# EAGLE design PiezoPreamp (EAGLE 7.5.0)
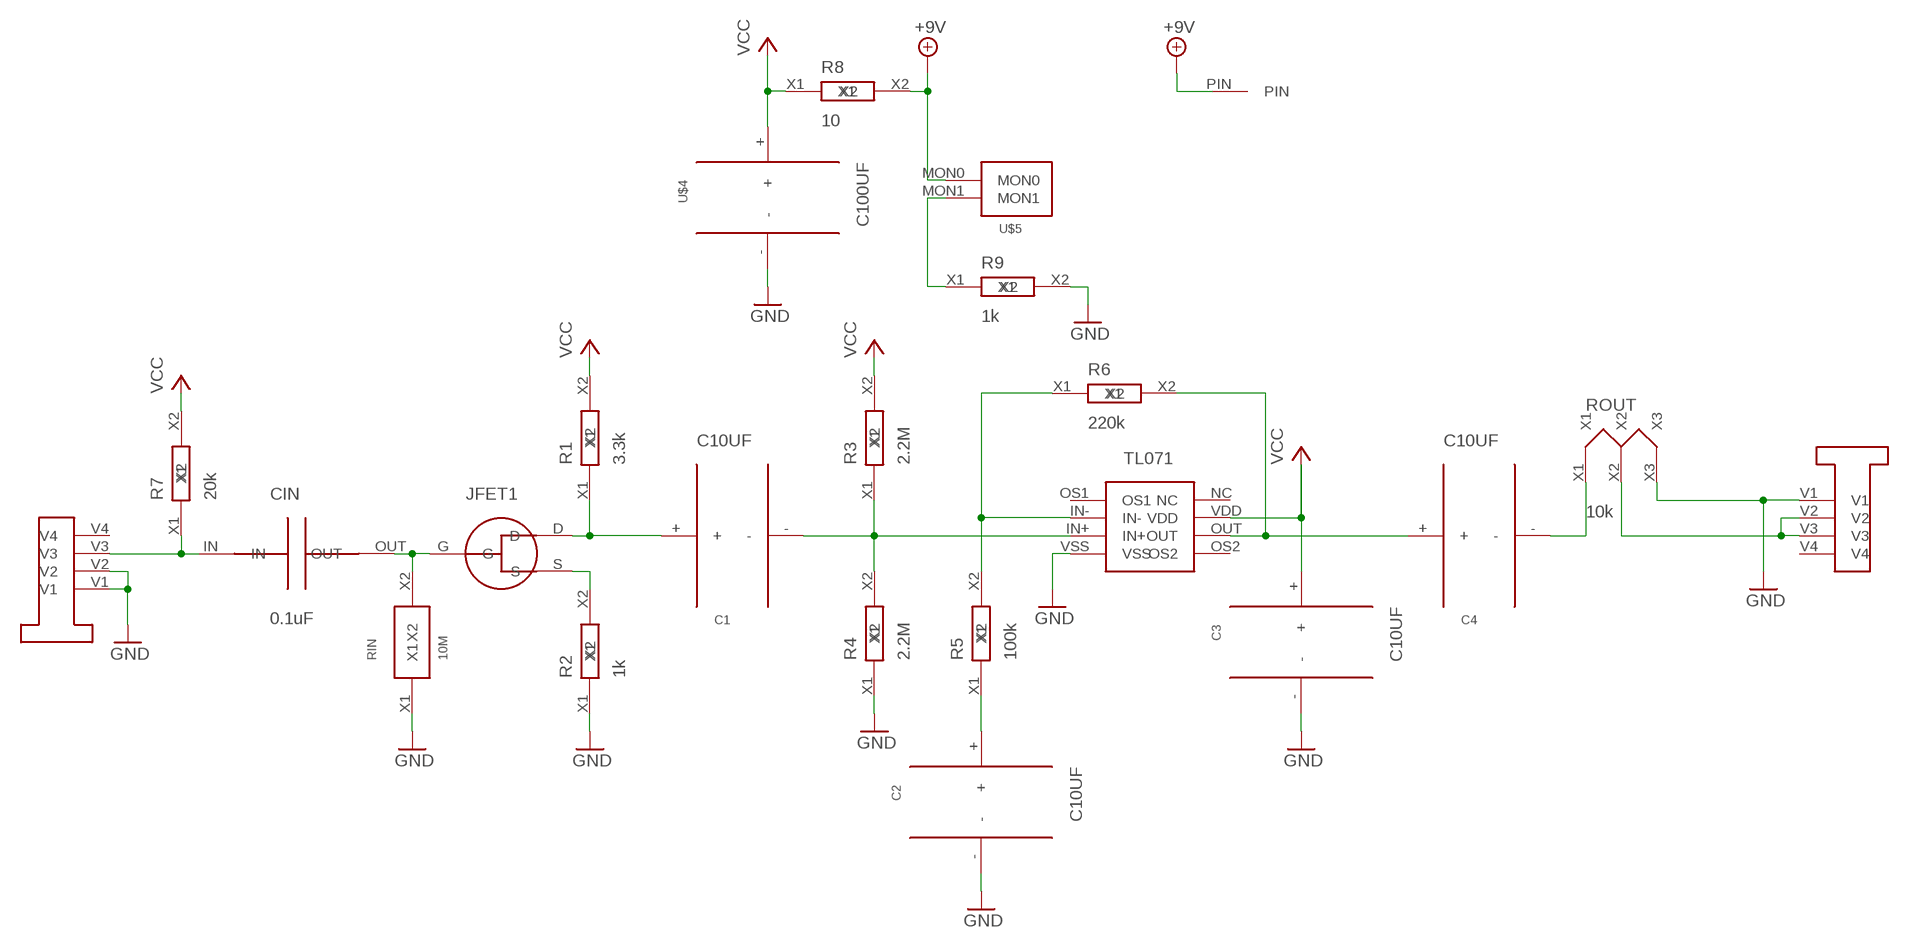
[diagram p0: schematic, sheet 1]

## Parts
C1  C10UF  [C10UF]
C2  C10UF  [C10UF]
C3  C10UF  [C10UF]
C4  C10UF  [C10UF]
CIN  0.1uF  C_CER_5MM  [C_CER_5MM]
JFET1  2N5457_H  [2N5457_H]
R1  3.3k  R_SMD_2.1X1.25  [SMD_2.1X1.25]
R2  1k  R_SMD_2.1X1.25  [SMD_2.1X1.25]
R3  2.2M  R_SMD_2.1X1.25  [SMD_2.1X1.25]
R4  2.2M  R_SMD_2.1X1.25  [SMD_2.1X1.25]
R5  100k  R_SMD_2.1X1.25  [SMD_2.1X1.25]
R6  220k  R_SMD_2.1X1.25  [SMD_2.1X1.25]
R7  20k  R_SMD_2.1X1.25  [SMD_2.1X1.25]
R8  10  R_SMD_2.1X1.25  [SMD_2.1X1.25]
R9  1k  R_SMD_2.1X1.25  [SMD_2.1X1.25]
RIN  10M  R_MOM  [R_MOM]
ROUT  10k  R_VAR_PTV09A  [R_VAR_PTV09A]
TL071  TL071  [TL071]
U$1  ST_AUDIO  [ST_AUDIO]
U$2  ST_AUDIO  [ST_AUDIO]
U$3  PIN_1  [PIN_1]
U$4  C100UF  [C100UF]
U$5  MON2PIN  [MON2PIN]

## Nets
+9V: R8.X2 U$3.PIN U$5.MON0
GND: C2.- C3.- R2.X1 R4.X1 R9.X2 RIN.X1 ROUT.X3 TL071.VSS U$1.V1 U$1.V2 U$2.V1 U$4.-
N$1: CIN.OUT JFET1.G RIN.X2
N$2: C1.+ JFET1.D R1.X1
N$3: JFET1.S R2.X2
N$4: C1.- R3.X1 R4.X2 TL071.IN+
N$5: C2.+ R5.X1
N$6: R5.X2 R6.X1 TL071.IN-
N$7: C4.+ R6.X2 TL071.OUT
N$8: CIN.IN R7.X1 U$1.V3
N$9: R9.X1 U$5.MON1
N$10: ROUT.X2 U$2.V2 U$2.V3
N$11: C4.- ROUT.X1
VCC: C3.+ R1.X2 R3.X2 R7.X2 R8.X1 TL071.VDD U$4.+
Unconnected: TL071.NC TL071.OS1 TL071.OS2 U$1.V4 U$2.V4

## Library data of the parts
C1-C4 = MyAmps:C10UF
CIN = MyDuino:C_CER_5MM
JFET1 = MyAmps:2N5457_H
R1-R9 = MyPowerComponents:R_SMD_2.1X1.25
RIN = MyAmps:R_MOM
ROUT = MyAmps:R_VAR_PTV09A
TL071 = MyAmps:TL071
U$1 U$2 = My_STM32F767:ST_AUDIO
U$3 = My_BLE:PIN_1
U$4 = MyAmps:C100UF
U$5 = MyCMOSsensor:MON2PIN

## Board
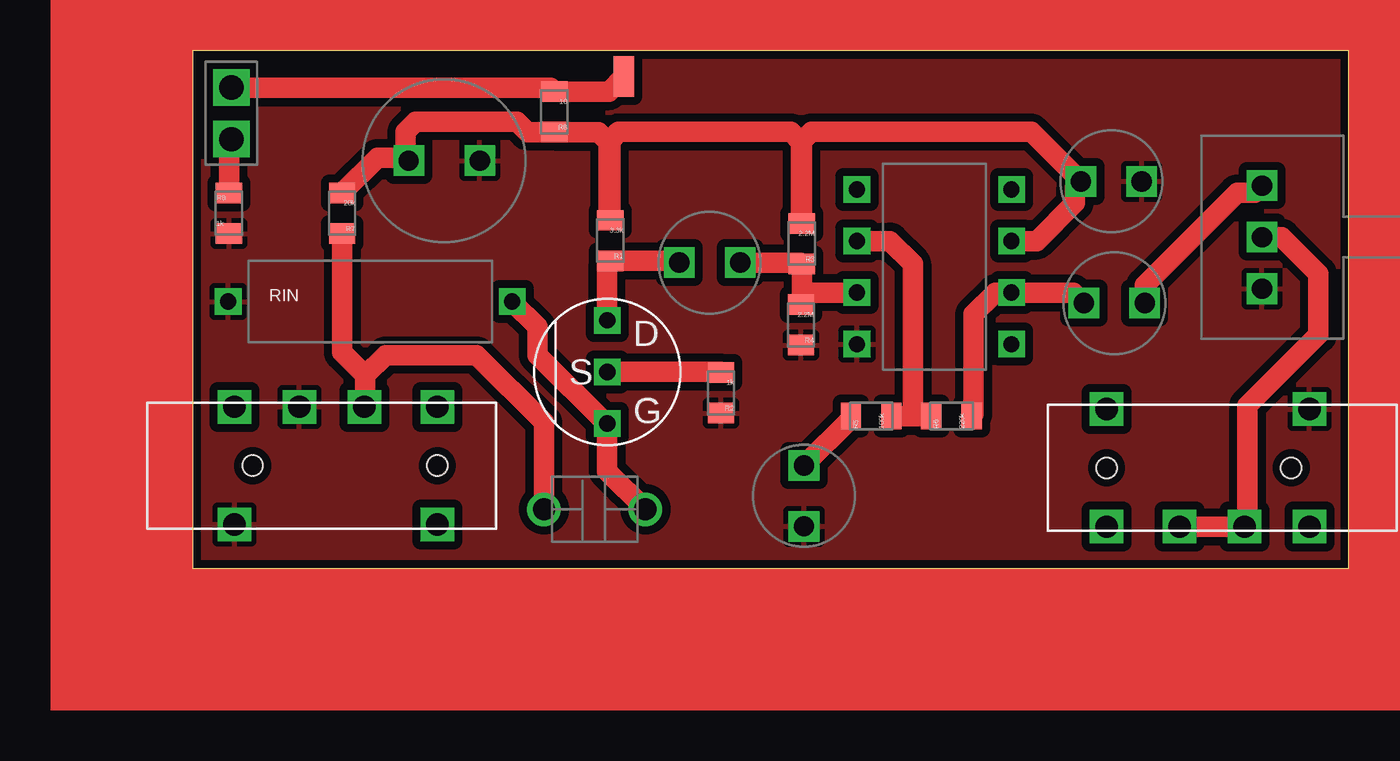
[diagram p1: board, top side]
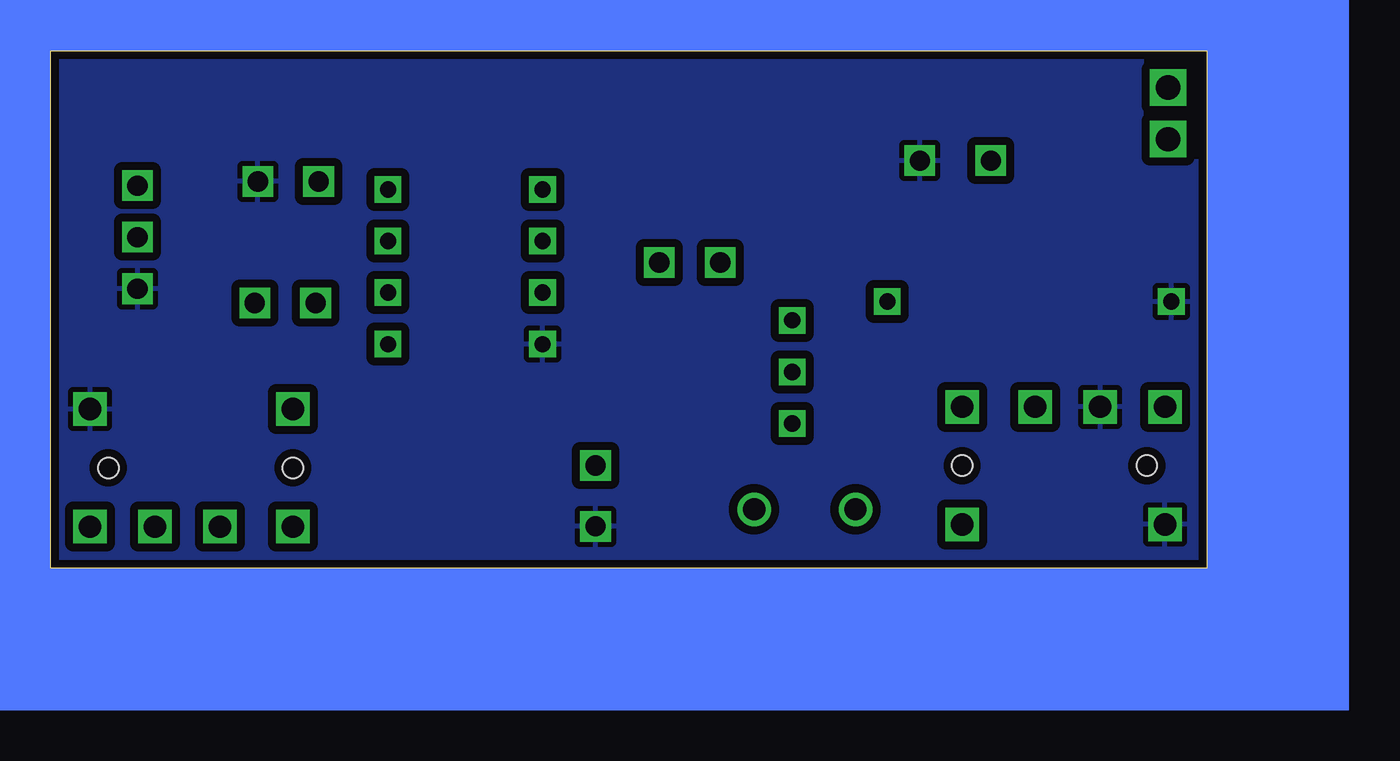
[diagram p2: board, bottom side, seen from below]

Size 57 x 25.5 mm. Coordinates in mm from the lower left corner, seen from the top.
Outline: 0,0 57,0 57,25.5 0,25.5 0,0
Copper layers (1*16): Top 0.035mm / dielectric 1.5mm / Bottom 0.035mm
Design rules "default *": minimum track width 10mil, minimum drill 24mil, track to track 8mil, track to pad 8mil, pad to pad 8mil, via to via 8mil, smd to smd 8mil, copper to edge 5mil, drill to drill 8mil, minimum pad ring 10mil, minimum via ring 8mil, stop-mask expansion 4mil, vias tented up to drill 0mil, thermal gap 10mil

### Footprints (pad centres in the part's own frame; a part is rotated, then mirrored left to right if it is on the bottom)
C10UF = drill 1 square: + -1.5,0; - 1.5,0
C_CER_5MM = drill 1.1: IN -2.5,0; OUT 2.5,0
2N5457_H = drill 0.8 square: D 0,2.54; G 0,-2.54; S 0,0
SMD_2.1X1.25 = smd 1.3 x 1: X1 0,1; X2 0,-1
R_MOM = drill 0.8 square: X1 -7,0; X2 7,0
R_VAR_PTV09A = drill 1 square: X1 -2.54,0; X2 0,0; X3 2.54,0
TL071 = drill 0.8 square: IN+ -3.81,0; IN- -3.81,2.54; NC 3.81,5.08; OS1 -3.81,5.08; OS2 3.81,-2.54; OUT 3.81,0; VDD 3.81,2.54; VSS -3.81,-2.54
ST_AUDIO = drill 1.1 square: V1 10,2.9; V2 6.8,-2.9; V3 3.6,-2.9; V4 0,2.9; V11 10,-2.9; V44 0,-2.9 | hole 1: 0,0; 9.1,0
PIN_1 = smd 2 x 1: PIN 0,0
C100UF = drill 1 square: + -1.75,0; - 1.75,0
MON2PIN = drill 1.2 square: MON0 0,2.54; MON1 0,0

### Placement (x,y rotation side)
C1  25.49,15.06 0 top
C2  30.14,3.56 270 top
C3  45.29,19.06 0 top
C4  45.44,13.06 0 top
CIN  19.82,2.9 0 top
JFET1  20.44,9.67 0 top
R1  20.59,16.14 180 top
R2  26.05,8.64 180 top
R3  30.03,15.99 180 top
R4  29.99,11.99 180 top
R5  33.45,7.49 90 top
R6  37.41,7.49 90 top
R7  7.37,17.49 180 top
R8  17.83,22.49 180 top
R9  1.79,17.49 0 top
RIN  8.75,13.14 0 top
ROUT  52.72,16.31 270 top
TL071  36.56,13.58 0 top
U$1  12.06,5.05 180 top
U$2  45.06,4.94 0 top
U$3  21.25,24.22 90 top
U$4  12.4,20.08 0 top
U$5  1.91,21.14 0 top

### Tracks (layer width: path | path; a pad name or v marks a point on that pad's centre or on a via)
+9V
  Top 1.016: U$5.MON0 17.64,23.68 R8.X2 20.52,23.49 U$3.PIN
GND
  pour Bottom (isolate 0.406): 0,0 57,0 57,25.5 0,25.5
  pour Top (isolate 0.406): 0,0 57,0 57,25.5 0,25.5
N$1
  Top 1.016: CIN.OUT 20.44,4.78 JFET1.G 20.37,7.13 17,10.5 17,11.89 RIN.X2
N$2
  Top 1.016: JFET1.D 20.44,14.99 R1.X1 23.91,15.14 C1.+
N$3
  Top 1.016: JFET1.S 26.02,9.67 R2.X2
N$4
  Top 1.016: C1.- 29.96,15.06 R3.X1 30.03,13.5 | 30.03,13.5 30.03,13.03 R4.X2 | TL071.IN+ 30.11,13.58 30.03,13.5
N$5
  Top 1.016: R5.X1 32.45,7.37 C2.+
N$6
  Top 1.016: R5.X2 35.5,7.49 | 35.5,7.49 R6.X1 | TL071.IN- 34.38,16.12 35.5,15 35.5,7.49
N$7
  Top 1.016: R6.X2 38.5,7.58 38.5,12.5 39.58,13.58 TL071.OUT 43.42,13.58 C4.+
N$8
  Top 1.016: R7.X1 7.37,10.63 8.5,9.5 | 8.5,9.5 8.5,7.99 U$1.V3 | CIN.IN 17.32,7.18 14,10.5 9.5,10.5 8.5,9.5
N$9
  Top 1.016: R9.X1 1.79,21.02 U$5.MON1
N$10
  Top 1.016: ROUT.X2 53.69,16.31 55.5,14.5 55.5,11.5 52,8 52,2.18 U$2.V2 U$2.V3
N$11
  Top 1.016: C4.- 46.94,13.94 51.5,18.5 52.37,18.5 ROUT.X1
VCC
  Top 1.016: 10.5,20.23 10.5,21.5 11,22 16,22 16.51,21.49 R8.X1 20.01,21.49 20.5,21 20.5,17.23 R1.X2 20.59,21.09 21,21.5 29.5,21.5 30,21 30,17.02 R3.X2 30.03,21.03 30.5,21.5 41.35,21.5 C3.+ 43.5,18.77 43.5,18 41.62,16.12 TL071.VDD | 10.5,20.23 U$4.+ | 10.5,20.23 9.11,20.23 R7.X2
(copper drawn outside any net)
  shapes: Bottom area x4, Top area x5